# EAGLE design ArduinoAdapter (EAGLE 9.6.2)
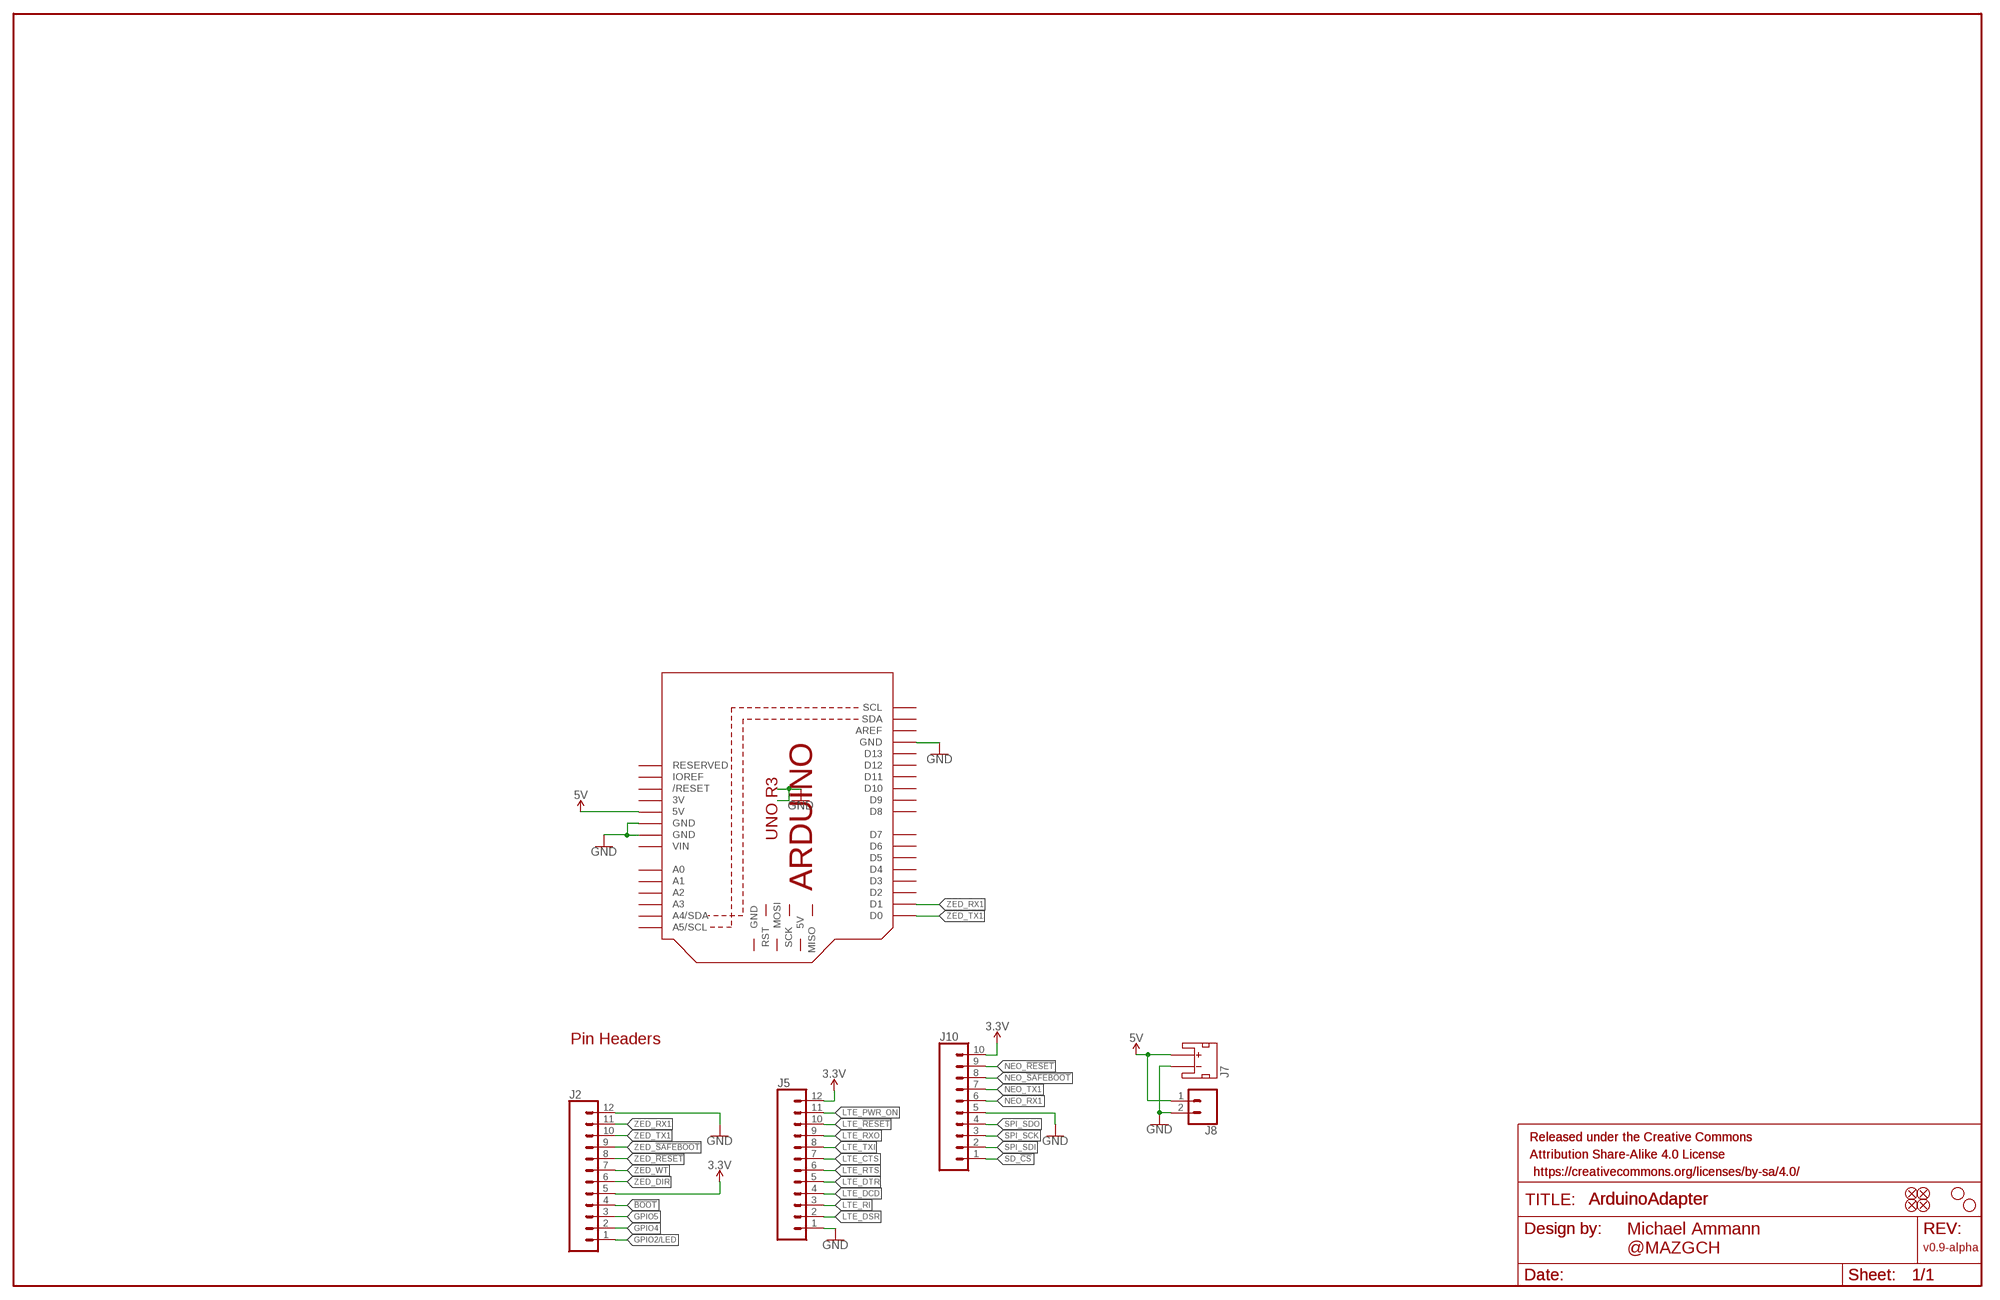
[diagram p0: schematic, sheet 1]

## Parts
FD1  FIDUCIALUFIDUCIAL  [FIDUCIAL-MICRO]
FD2  FIDUCIALUFIDUCIAL  [FIDUCIAL-MICRO]
FD3  FIDUCIALUFIDUCIAL  [FIDUCIAL-MICRO]
FD4  FIDUCIALUFIDUCIAL  [FIDUCIAL-MICRO]
FRAME1  FRAME-LEDGER  [CREATIVE_COMMONS]
FRAME2  FRAME-LEDGER  [CREATIVE_COMMONS]
H1  STAND-OFFTIGHT  [STAND-OFF-TIGHT]
H4  STAND-OFFTIGHT  [STAND-OFF-TIGHT]
J2  CONN_12NO_SILK  [1X12_NO_SILK]
J5  CONN_12NO_SILK  [1X12_NO_SILK]
J7  JST_2MM_MALE  [JST-2-SMD]
J8  CONN_021X02_NO_SILK  [1X02_NO_SILK]
J10  CONN_10NO_SILK_PTH_FEMALE  [1X10_NO_SILK]
M1  ARDUINO_R3_ICSP  [ARDUINOR3_ICSP]

## Nets
3.3V [supply]: J2.5 J5.12 J10.10
5V [power]: J7.2(+) J8.1 M1.5V
!BOOT!: J2.4
GND: J2.12 J5.1 J7.1(-) J8.2 J10.5 M1.GND M1.GND@1(GND) M1.GND@3(GND)
GPIO2/LED: J2.1
GPIO4: J2.2
GPIO5: J2.3
LTE_!RESET!: J5.10
LTE_CTS: J5.7
LTE_DCD: J5.4
LTE_DSR: J5.2
LTE_DTR: J5.5
LTE_PWR_ON: J5.11
LTE_RI: J5.3
LTE_RTS: J5.6
LTE_RXO: J5.9
LTE_TXI: J5.8
NEO_!RESET!: J10.9
NEO_!SAFEBOOT!: J10.8
NEO_RX1: J10.6
NEO_TX1: J10.7
SD_!CS!: J10.1
SPI_SCK: J10.3
SPI_SDI: J10.2
SPI_SDO: J10.4
ZED_!RESET!: J2.8
ZED_!SAFEBOOT!: J2.9
ZED_DIR: J2.6
ZED_RX1: J2.11 M1.D1
ZED_TX1: J2.10 M1.D0
ZED_WT: J2.7
Unconnected: J7.NC1(PAD1) J7.NC2(PAD2) M1.5V_ICSP(5V) M1.A0 M1.A1 M1.A2 M1.A3 M1.A4(A4/SDA) M1.A5(A5/SCL) M1.AREF M1.D2 M1.D3 M1.D4 M1.D5 M1.D6 M1.D7 M1.D8 M1.D9 M1.D10 M1.D11 M1.D12 M1.D13 M1.GND@2(GND) M1.IOREF M1.MISO M1.MOSI M1.RESERVED M1.RESET(/RESET) M1.RESET_ICSP(RST) M1.SCK M1.SCL M1.SDA

## Notes on the sheet
- Pin Headers
- v0.9-alpha
- Michael Ammann 
  @MAZGCH

## Power pins joined to a net without a drawn wire
3V: M1.3V
VIN: M1.VIN

## Library data of the parts
FD1-FD4 = SparkFun-Aesthetics:FIDUCIAL: Fiducial Alignment Points Point-of-reference for pick-and-place machines and other optical instruments.
FRAME1 FRAME2 = SparkFun-Aesthetics:FRAME-LEDGER: Schematic Frame - Ledger Standard 11x14 US Ledger frame
H1 H4 = SparkFun-Hardware:STAND-OFF: Stand Off Drill holes for mechanically mounting via screws, standoffs, etc. Note: Use the keepout ring to avoid running the screw head into surrounding components. Variant Overviews STAND-OFF - Mechanical footprint for a #4 phillips button head screw. STAND-OFF-TIGHT - Mechanical footprint for a #4 phillips button head screw, Example SparkFun Products Screw - Phillips Head (1/4", 4-40, 10 pack) <https://www.sparkfun.com/products/10453> (PRT-10453) Screw - Phillips Head (1/2", 4-40, 10 pack) <https://www.sparkfun.com/products/10452> (PRT-10452) Screw - Phillips Head (3/4", 4-40, 10 pack) <https://www.sparkfun.com/products/10451> (PRT-10451) Screw - Phillips Head (1", 4-40, 10 pack) <https://www.sparkfun.com/products/10450> (PRT-10450)
J2 J5 = SparkFun-Connectors:CONN_12: Multi connection point. Often used as Generic Header-pin footprint for 0.1 inch spaced/style header connections On any of the 0.1 inch spaced packages, you can populate with these: Break Away Headers - Straight <https://www.sparkfun.com/products/116> (PRT-00116) Break Away Male Headers - Right Angle <https://www.sparkfun.com/products/553> (PRT-00553) Female Headers <https://www.sparkfun.com/products/115> (PRT-00115) Break Away Headers - Machine Pin <https://www.sparkfun.com/products/117> (PRT-00117) Break Away Female Headers - Swiss Machine Pin <https://www.sparkfun.com/products/743> (PRT-00743) For SCREWTERMINALS and SPRING TERMINALS visit here: Screw Terimnals on SparkFun.com <https://www.sparkfun.com/search/results?term=Screw+Terminals> (5mm/3.5mm/2.54mm spacing) This device is also useful as a general connection point to wire up your design to another part of your project. Our various solder wires solder well into these plated through hole pads. Hook-Up Wire - Assortment (Stranded, 22 AWG) <https://www.sparkfun.com/products/11375> (PRT-11375) Hook-Up Wire - Assortment (Solid Core, 22 AWG) <https://www.sparkfun.com/products/11367> (PRT-11367) View the entire wire category on our website here <https://www.sparkfun.com/categories/141> Special notes: Molex polarized connector foot print use with SKU : PRT-08231 with associated crimp pins and housings. 1MM SMD Version SKU: PRT-10208 NOTES ON THE VARIANTS LOCK and LOCK_LONGPADS... This footprint was designed to help hold the alignment of a through-hole component (i.e. 6-pin header) while soldering it into place. You may notice that each hole has been shifted either up or down by 0.005 of an inch from it's more standard position (which is a perfectly straight line). This slight alteration caused the pins (the squares in the middle) to touch the edges of the holes. Because they are alternating, it causes a "brace" to hold the component in place. 0.005 has proven to be the perfect amount of "off-center" position when using our standard breakaway headers. Although looks a little odd when you look at the bare footprint, once you have a header in there, the alteration is very hard to notice. Also,if you push a header all the way into place, it is covered up entirely on the bottom side.
J7 = SparkFun-Connectors:JST_2MM_MALE: JST 2MM MALE RA CONNECTOR Two pin, compact surface mount connector. Commonly used as a battery input connection point. We really like the solid locking feeling and high current rating on these small connectors. We use these all the time as battery connectors. Mates to single-cell LiPo batteries. Here is the connector we sell at SparkFun: JST Right Angle Connector - White <https://www.sparkfun.com/products/8612> (PRT-08612) Datasheet <http://www.sparkfun.com/datasheets/Prototyping/Connectors/JST-Horizontal.pdf> It was used on these SparkFun products: SparkFun MOSFET Power Controller <https://www.sparkfun.com/products/11214> (PRT-11214) SparkFun Battery Babysitter - LiPo Battery Manager <https://www.sparkfun.com/products/13777> (PRT-13777) And many, many others that required a lipo battery connection.; PROD_ID: CONN-11443; SF_ID: PRT-08612
J8 = SparkFun-Connectors:CONN_02: Multi connection point. Often used as Generic Header-pin footprint for 0.1 inch spaced/style header connections On any of the 0.1 inch spaced packages, you can populate with these: Break Away Headers - Straight <https://www.sparkfun.com/products/116> (PRT-00116) Break Away Male Headers - Right Angle <https://www.sparkfun.com/products/553> (PRT-00553) Female Headers <https://www.sparkfun.com/products/115> (PRT-00115) Break Away Headers - Machine Pin <https://www.sparkfun.com/products/117> (PRT-00117) Break Away Female Headers - Swiss Machine Pin <https://www.sparkfun.com/products/743> (PRT-00743) For SCREWTERMINALS and SPRING TERMINALS visit here: Screw Terimnals on SparkFun.com <https://www.sparkfun.com/search/results?term=Screw+Terminals> (5mm/3.5mm/2.54mm spacing) This device is also useful as a general connection point to wire up your design to another part of your project. Our various solder wires solder well into these plated through hole pads. Hook-Up Wire - Assortment (Stranded, 22 AWG) <https://www.sparkfun.com/products/11375> (PRT-11375) Hook-Up Wire - Assortment (Solid Core, 22 AWG) <https://www.sparkfun.com/products/11367> (PRT-11367) View the entire wire category on our website here <https://www.sparkfun.com/categories/141> Special notes: Molex polarized connector foot print use with: PRT-08233 with associated crimp pins and housings. 2.54_SCREWTERM for use with PRT-10571. 3.5mm Screw Terminal footprints for PRT-08084 5mm Screw Terminal footprints for use with PRT-08432
J10 = SparkFun-Connectors:CONN_10: Multi connection point. Often used as Generic Header-pin footprint for 0.1 inch spaced/style header connections On any of the 0.1 inch spaced packages, you can populate with these: Break Away Headers - Straight <https://www.sparkfun.com/products/116> (PRT-00116) Break Away Male Headers - Right Angle <https://www.sparkfun.com/products/553> (PRT-00553) Female Headers <https://www.sparkfun.com/products/115> (PRT-00115) Break Away Headers - Machine Pin <https://www.sparkfun.com/products/117> (PRT-00117) Break Away Female Headers - Swiss Machine Pin <https://www.sparkfun.com/products/743> (PRT-00743) Arduino Stackable Header - 10 Pin <https://www.sparkfun.com/products/11376> (PRT-11376) For SCREWTERMINALS and SPRING TERMINALS visit here: Screw Terimnals on SparkFun.com <https://www.sparkfun.com/search/results?term=Screw+Terminals> (5mm/3.5mm/2.54mm spacing) This device is also useful as a general connection point to wire up your design to another part of your project. Our various solder wires solder well into these plated through hole pads. Hook-Up Wire - Assortment (Stranded, 22 AWG) <https://www.sparkfun.com/products/11375> (PRT-11375) Hook-Up Wire - Assortment (Solid Core, 22 AWG) <https://www.sparkfun.com/products/11367> (PRT-11367) View the entire wire category on our website here <https://www.sparkfun.com/categories/141> Special notes: Molex polarized connector foot print use with SKU : PRT-08231 with associated crimp pins and housings. 1MM SMD Version SKU: PRT-10208 NOTES ON THE VARIANTS LOCK and LOCK_LONGPADS... This footprint was designed to help hold the alignment of a through-hole component (i.e. 6-pin header) while soldering it into place. You may notice that each hole has been shifted either up or down by 0.005 of an inch from it's more standard position (which is a perfectly straight line). This slight alteration caused the pins (the squares in the middle) to touch the edges of the holes. Because they are alternating, it causes a "brace" to hold the component in place. 0.005 has proven to be the perfect amount of "off-center" position when using our standard breakaway headers. Although looks a little odd when you look at the bare footprint, once you have a header in there, the alteration is very hard to notice. Also,if you push a header all the way into place, it is covered up entirely on the bottom side.; PROD_ID: CONN-11563
M1 = adafruit:ARDUINO_R3_ICSP

## Net classes
0 default: width 0.203 mm
1 power: width 0.813 mm
2 supply: width 0.406 mm
3 RF: width 0.813 mm, clearance 0.127 mm
4 DiffPair: width 0.152 mm, clearance 0.178 mm

## Board
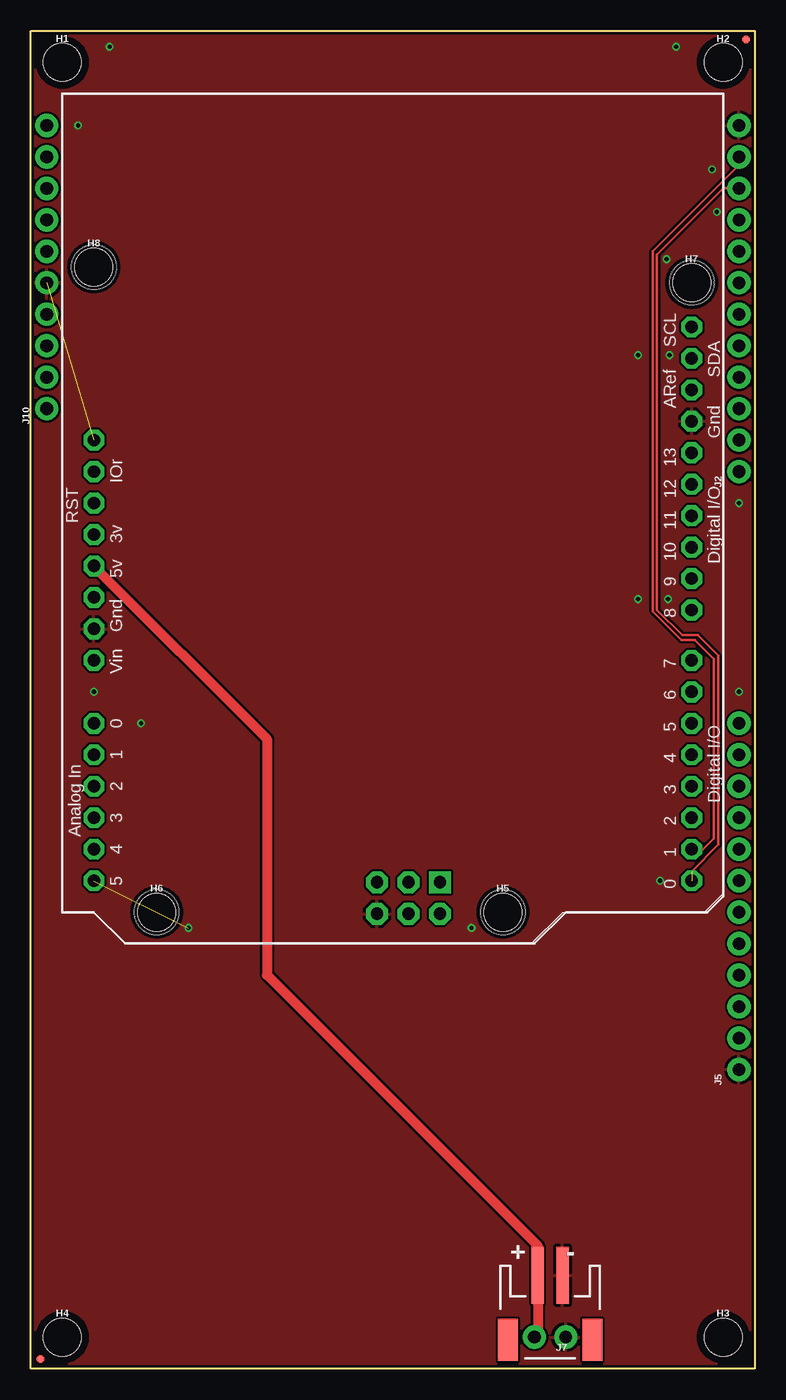
[diagram p1: board, top side]
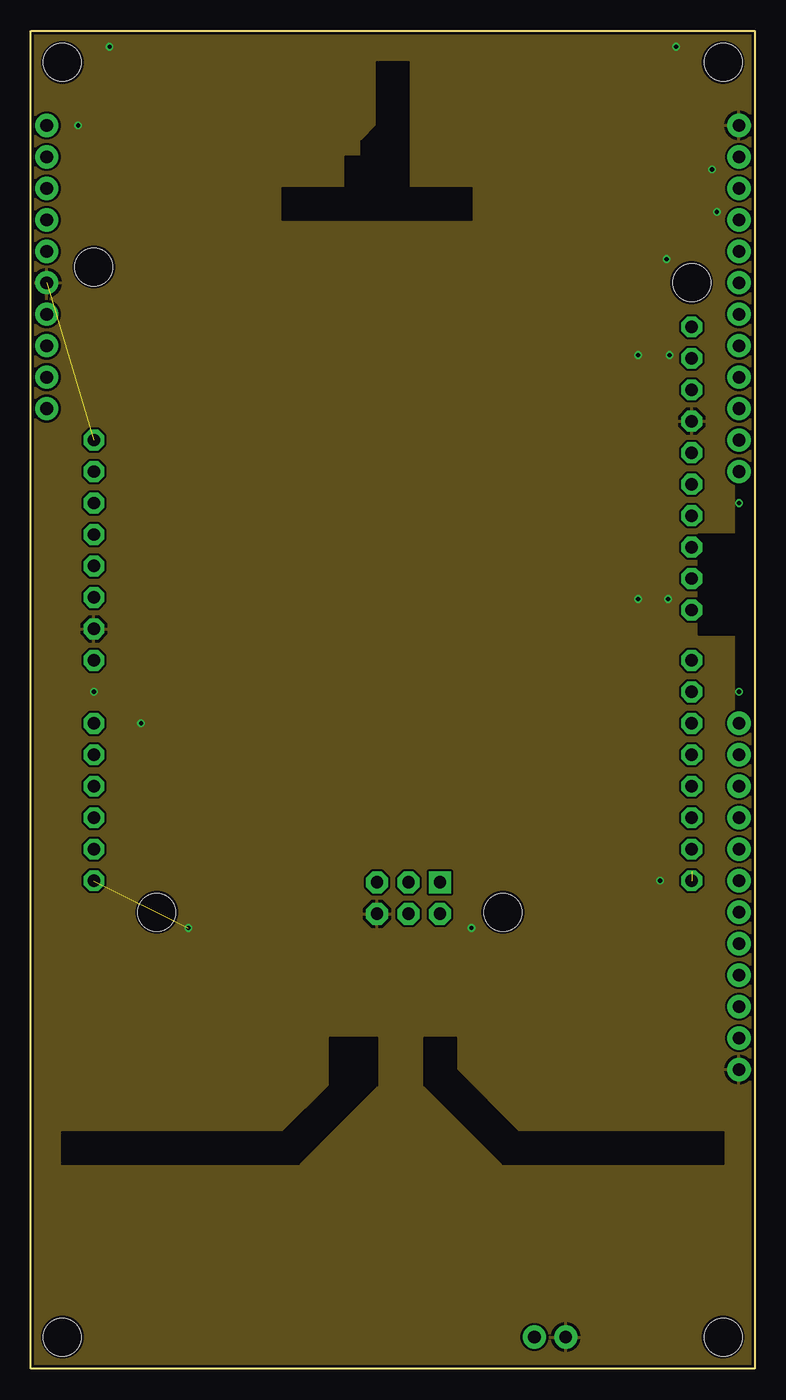
[diagram p2: board, inner layer Route2]
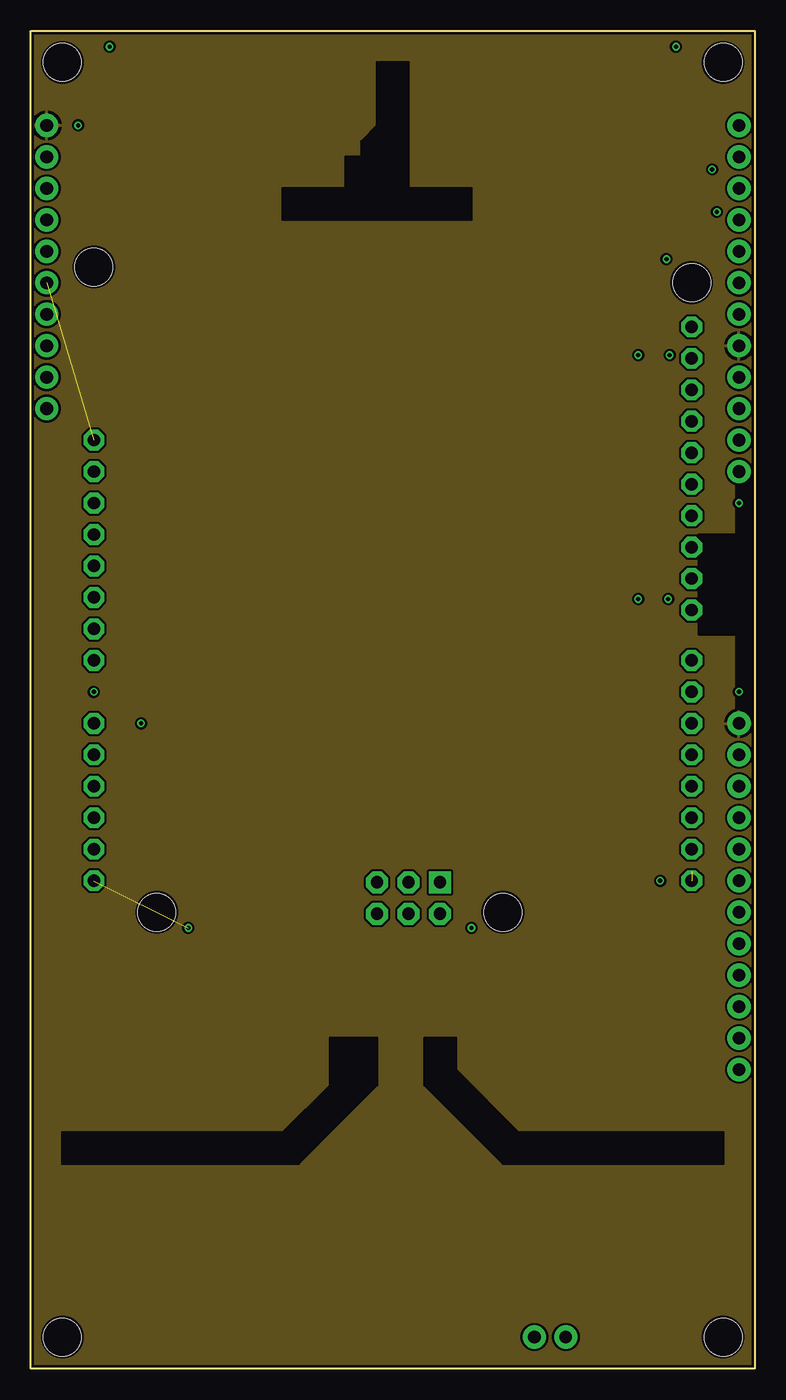
[diagram p3: board, inner layer Route15]
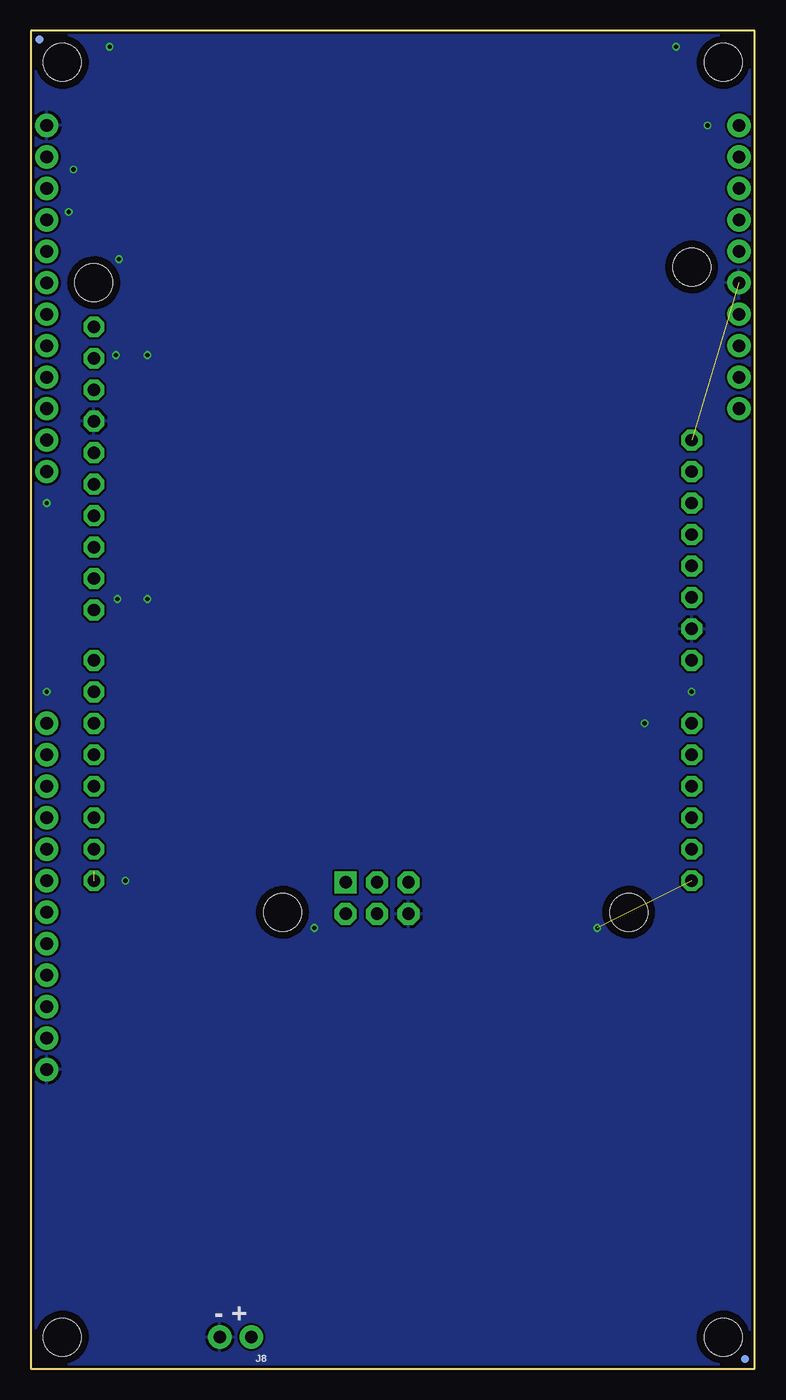
[diagram p4: board, bottom side, seen from below]

Size 58.42 x 107.95 mm. Coordinates in mm from the lower left corner, seen from the top.
Outline: 0,0 0,107.95 58.42,107.95 58.42,0 0,0
Copper layers (1*16): Top 0.035mm / dielectric 0.2mm / Bottom 0.035mm
Design rules "SparkFun-4-layer-1oz-JLCPCB *": minimum track width 5mil, minimum drill 0.2mm, track to track 5mil, track to pad 0.2mm, pad to pad 5mil, via to via 0.2mm, smd to smd 0mil, copper to edge 0.2mm, drill to drill 10mil, minimum pad ring 0.13mm, minimum via ring 0.13mm, stop-mask expansion 0.05mm, vias tented up to drill 25mil, thermal gap 10mil

### Footprints (pad centres in the part's own frame; a part is rotated, then mirrored left to right if it is on the bottom)
FIDUCIAL-MICRO = smd 0.635 x 0.635: 1 0,0
STAND-OFF-TIGHT = hole 3.048: 0,0
1X12_NO_SILK = drill 1.016 pad 1.88: 1 0,0; 2 2.54,0; 3 5.08,0; 4 7.62,0; 5 10.16,0; 6 12.7,0; 7 15.24,0; 8 17.78,0; 9 20.32,0; 10 22.86,0; 11 25.4,0; 12 27.94,0
JST-2-SMD = smd 1 x 4.6: 1 -1,-3.7; 2 1,-3.7 | smd 1.6 x 3.4: NC1 -3.4,1.5; NC2 3.4,1.5
1X02_NO_SILK = drill 1.016 pad 1.88: 1 0,0; 2 2.54,0
1X10_NO_SILK = drill 1.016 pad 1.88: 1 0,0; 2 2.54,0; 3 5.08,0; 4 7.62,0; 5 10.16,0; 6 12.7,0; 7 15.24,0; 8 17.78,0; 9 20.32,0; 10 22.86,0
ARDUINOR3_ICSP = drill 1 pad 1.676 octagon: 3V 35.56,2.54; 5V 38.1,2.54; A0 50.8,2.54; A1 53.34,2.54; A2 55.88,2.54; A3 58.42,2.54; A4 60.96,2.54; A5 63.5,2.54; AREF 23.876,50.8; D0 63.5,50.8; D1 60.96,50.8; D2 58.42,50.8; D3 55.88,50.8; D4 53.34,50.8; D5 50.8,50.8; D6 48.26,50.8; D7 45.72,50.8; D8 41.656,50.8; D9 39.116,50.8; D10 36.576,50.8; D11 34.036,50.8; D12 31.496,50.8; D13 28.956,50.8; GND 26.416,50.8; GND@1 43.18,2.54; GND@2 40.64,2.54; IOREF 30.48,2.54; RESERVED 27.94,2.54; RESET 33.02,2.54; SCL 18.796,50.8; SDA 21.336,50.8; VIN 45.72,2.54 | drill 1 pad 1.778 octagon: 5V_ICSP 66.167,30.48; GND@3 66.167,25.4; MOSI 66.167,27.94; RESET_ICSP 63.627,25.4; SCK 63.627,27.94 | drill 1 pad 1.778 square: MISO 63.627,30.48

### Placement (x,y rotation side)
FD1  0.76,0.76 0 bottom
FD2  57.72,107.25 0 bottom
FD3  57.72,107.25 0 top
FD4  0.76,0.76 0 top
FRAME1  10.16,118.11 0 top  (outside the outline)
FRAME2  10.16,118.11 0 top  (outside the outline)
H1  2.54,105.41 0 top
H2  STAND-OFFTIGHT  [STAND-OFF-TIGHT]  55.88,105.41 0 top
H3  STAND-OFFTIGHT  [STAND-OFF-TIGHT]  55.88,2.54 0 top
H4  2.54,2.54 0 top
H5  STAND-OFFTIGHT  [STAND-OFF-TIGHT]  38.1,36.83 0 top
H6  STAND-OFFTIGHT  [STAND-OFF-TIGHT]  10.16,36.83 0 top
H7  STAND-OFFTIGHT  [STAND-OFF-TIGHT]  53.34,87.63 0 top
H8  STAND-OFFTIGHT  [STAND-OFF-TIGHT]  5.08,88.9 0 top
J2  57.15,72.39 90 top
J5  57.15,24.13 90 top
J7  41.91,3.81 180 top
J8  40.64,2.54 180 bottom
J10  1.27,77.47 90 top
M1  2.54,102.87 270 top

### Tracks (layer width: path | path; a pad name or v marks a point on that pad's centre or on a via)
3.3V
  pour Route15 (isolate 0.178, rank 3): 0,0 0,107.95 58.42,107.95 58.42,0
5V
  Top 0.813: M1.5V 19.05,50.8 19.05,31.75 40.91,9.89 J7.2 40.91,6.35 40.91,2.81 J8.1
GND  (via drill 0.35)  (2 unrouted)
  other vias: 5.08,54.61 57.15,69.85 57.15,54.61 35.56,35.56 12.7,35.56 6.35,106.68 52.07,106.68 51.31,89.53 51.56,81.79 51.44,62.1 50.8,39.37 5.08,39.37 8.89,52.07 5.08,74.93 3.81,100.33 49.02,62.1 49.02,81.79 54.99,96.77 55.37,93.34
  pour Bottom (isolate 0.178): 0,107.95 58.42,107.95 58.42,0 0,0
  pour Top (isolate 0.178, rank 3): 0,107.95 58.42,107.95 58.42,0 0,0
  pour Route2 (isolate 0.178, rank 3): 0,107.95 58.42,107.95 58.42,0 0,0
  cutout Route2: 56.96,53.21 56.96,59.25 53.91,59.25 53.91,67.31 56.96,67.31 56.96,71.18 58.42,71.18 58.42,53.21
  cutout Route15: 56.96,53.21 56.96,59.25 53.91,59.25 53.91,67.31 56.96,67.31 56.96,71.18 58.42,71.18 58.42,53.21
  cutout Route2: 55.88,16.51 55.88,19.05 39.37,19.05 34.29,24.13 34.29,26.67 31.75,26.67 31.75,22.86 38.1,16.51
  cutout Route2: 27.94,26.67 24.13,26.67 24.13,22.86 20.32,19.05 2.54,19.05 2.54,16.51 21.59,16.51 27.94,22.86
  cutout Route2: 30.48,105.41 27.94,105.41 27.94,100.33 26.67,99.06 26.67,97.79 25.4,97.79 25.4,95.25 20.32,95.25 20.32,92.71 35.56,92.71 35.56,95.25 30.48,95.25 30.48,97.79
  cutout Route15: 55.88,16.51 55.88,19.05 39.37,19.05 34.29,24.13 34.29,26.67 31.75,26.67 31.75,22.86 38.1,16.51
  cutout Route15: 27.94,26.67 24.13,26.67 24.13,22.86 20.32,19.05 2.54,19.05 2.54,16.51 21.59,16.51 27.94,22.86
  cutout Route15: 30.48,105.41 27.94,105.41 27.94,100.33 26.67,99.06 26.67,97.79 25.4,97.79 25.4,95.25 20.32,95.25 20.32,92.71 35.56,92.71 35.56,95.25 30.48,95.25 30.48,97.79
ZED_RX1
  Top 0.203: J2.11 57.15,97.13 50.22,90.2 50.22,61.08 52.49,58.8 53.59,58.8 55.12,57.28 55.12,42.8 54.23,41.91 M1.D1
ZED_TX1  (1 unrouted)
  Top 0.203: J2.10 55.9,95.25 50.55,89.89 50.55,61.21 52.58,59.18 53.85,59.18 55.5,57.53 55.5,42.29 53.34,40.13

### Text on the board
tPlace: + -
bPlace: - +
tDocu: Michael Ammann @MAZGCH